# EAGLE design 4x4CherryExpansion (EAGLE 7.5.0)
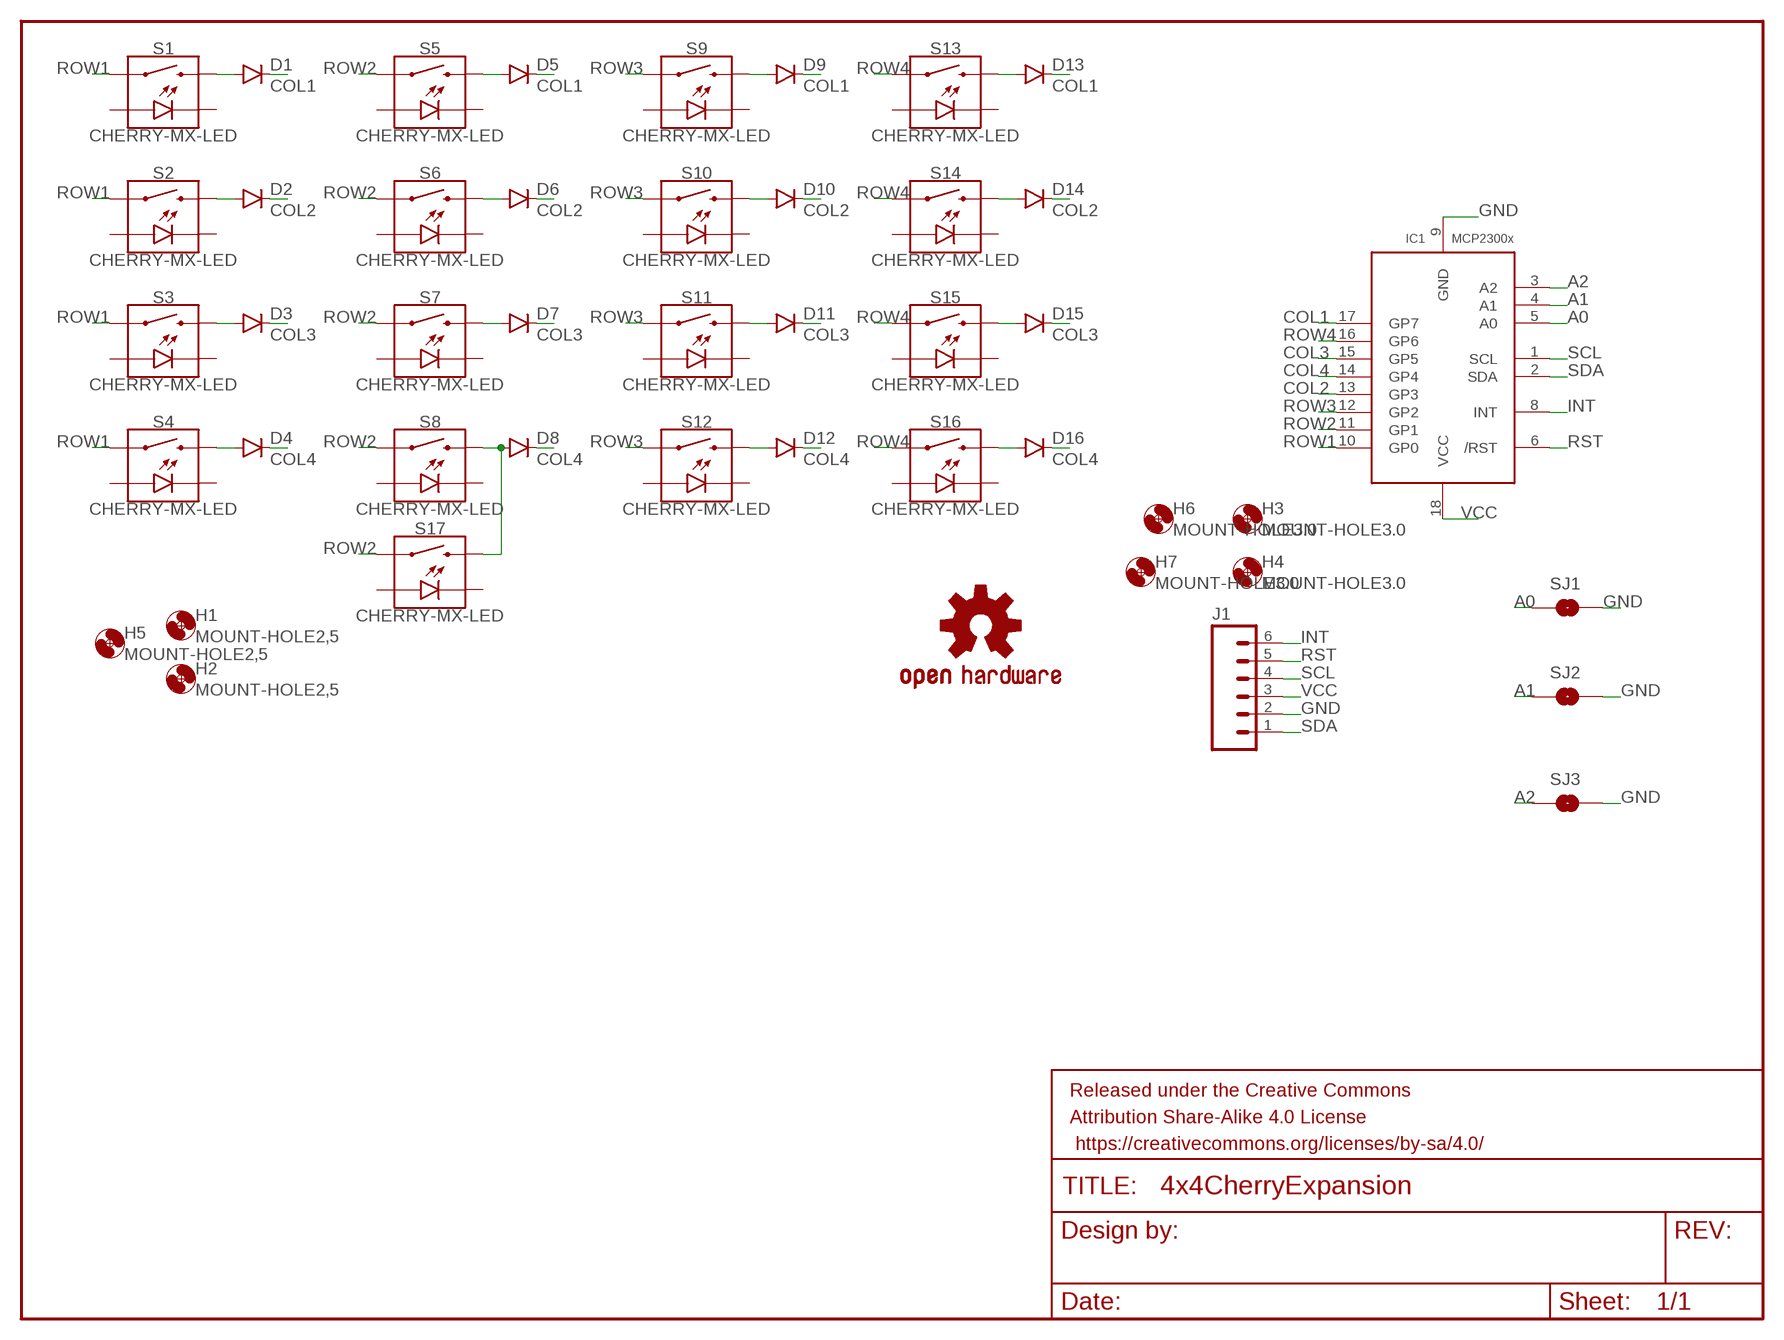
[diagram p0: schematic, sheet 1]

## Parts
D1  DIODEPTH  [DIODE-1N4001]
D2  DIODEPTH  [DIODE-1N4001]
D3  DIODEPTH  [DIODE-1N4001]
D4  DIODEPTH  [DIODE-1N4001]
D5  DIODEPTH  [DIODE-1N4001]
D6  DIODEPTH  [DIODE-1N4001]
D7  DIODEPTH  [DIODE-1N4001]
D8  DIODEPTH  [DIODE-1N4001]
D9  DIODEPTH  [DIODE-1N4001]
D10  DIODEPTH  [DIODE-1N4001]
D11  DIODEPTH  [DIODE-1N4001]
D12  DIODEPTH  [DIODE-1N4001]
D13  DIODEPTH  [DIODE-1N4001]
D14  DIODEPTH  [DIODE-1N4001]
D15  DIODEPTH  [DIODE-1N4001]
D16  DIODEPTH  [DIODE-1N4001]
FRAME1  FRAME-LETTER  [CREATIVE_COMMONS]
H1  MOUNT-HOLE2,5  [2,8]
H2  MOUNT-HOLE2,5  [2,8]
H3  MOUNT-HOLE3.0  [3,0]
H4  MOUNT-HOLE3.0  [3,0]
H5  MOUNT-HOLE2,5  [2,8]
H6  MOUNT-HOLE3.0  [3,0]
H7  MOUNT-HOLE3.0  [3,0]
IC1  MCP23008/P  [DIL18]
J1  M06SILK_FEMALE_PTH  [1X06]
LOGO1  OSHW-LOGOL  [OSHW-LOGO-L]
S1  CHERRY-MX-LED  [CHERRY-MX-LED]
S2  CHERRY-MX-LED  [CHERRY-MX-LED]
S3  CHERRY-MX-LED  [CHERRY-MX-LED]
S4  CHERRY-MX-LED  [CHERRY-MX-LED]
S5  CHERRY-MX-LED  [CHERRY-MX-LED]
S6  CHERRY-MX-LED  [CHERRY-MX-LED]
S7  CHERRY-MX-LED  [CHERRY-MX-LED]
S8  CHERRY-MX-LED  [CHERRY-MX-LED]
S9  CHERRY-MX-LED  [CHERRY-MX-LED]
S10  CHERRY-MX-LED  [CHERRY-MX-LED]
S11  CHERRY-MX-LED  [CHERRY-MX-LED]
S12  CHERRY-MX-LED  [CHERRY-MX-LED]
S13  CHERRY-MX-LED  [CHERRY-MX-LED]
S14  CHERRY-MX-LED  [CHERRY-MX-LED]
S15  CHERRY-MX-LED  [CHERRY-MX-LED]
S16  CHERRY-MX-LED  [CHERRY-MX-LED]
S17  CHERRY-MX-LED  [CHERRY-MX-LED]
SJ1  SOLDERJUMPERNO  [SJ_2S-NO]
SJ2  SOLDERJUMPERNO  [SJ_2S-NO]
SJ3  SOLDERJUMPERNO  [SJ_2S-NO]

## Nets
A0: IC1.5(A0) SJ1.1
A1: IC1.4(A1) SJ2.1
A2: IC1.3(A2) SJ3.1
COL1: D1.C D5.C D9.C D13.C IC1.17(GP7)
COL2: D2.C D6.C D10.C D14.C IC1.13(GP3)
COL3: D3.C D7.C D11.C D15.C IC1.15(GP5)
COL4: D4.C D8.C D12.C D16.C IC1.14(GP4)
GND: IC1.9(GND) J1.2 SJ1.2 SJ2.2 SJ3.2
INT: IC1.8(INT) J1.6
N$1: D9.A S9.S2
N$2: D10.A S10.S2
N$3: D1.A S1.S2
N$4: D11.A S11.S2
N$5: D12.A S12.S2
N$6: D13.A S13.S2
N$7: D14.A S14.S2
N$8: D3.A S3.S2
N$9: D2.A S2.S2
N$10: D15.A S15.S2
N$11: D16.A S16.S2
N$12: D8.A S8.S2 S17.S2
N$17: D4.A S4.S2
N$22: D5.A S5.S2
N$27: D6.A S6.S2
N$32: D7.A S7.S2
ROW1: IC1.10(GP0) S1.S1 S2.S1 S3.S1 S4.S1
ROW2: IC1.11(GP1) S5.S1 S6.S1 S7.S1 S8.S1 S17.S1
ROW3: IC1.12(GP2) S9.S1 S10.S1 S11.S1 S12.S1
ROW4: IC1.16(GP6) S13.S1 S14.S1 S15.S1 S16.S1
RST: IC1.6(/RST) J1.5
SCL: IC1.1(SCL) J1.4
SDA: IC1.2(SDA) J1.1
VCC: IC1.18(VCC) J1.3
Unconnected: S1.A S1.K(C) S2.A S2.K(C) S3.A S3.K(C) S4.A S4.K(C) S5.A S5.K(C) S6.A S6.K(C) S7.A S7.K(C) S8.A S8.K(C) S9.A S9.K(C) S10.A S10.K(C) S11.A S11.K(C) S12.A S12.K(C) S13.A S13.K(C) S14.A S14.K(C) S15.A S15.K(C) S16.A S16.K(C) S17.A S17.K(C)

## Library data of the parts
D1-D16 = SparkFun-DiscreteSemi:DIODE: Diode These are standard reverse protection diodes and small signal diodes. SMA package can handle up to about 1A. SOD-323 can handle about 200mA. What the SOD-323 package when ordering, there are some mfgs out there that are 5-pin packages.
FRAME1 = SparkFun-Aesthetics:FRAME-LETTER: Schematic Frame Standard 8.5x11 US Letter frame
H1-H7 = holes:MOUNT-HOLE: MOUNTING HOLE with drill center marker
IC1 = adafruit:MCP23008: MCP23008 Inexpensive i2c i/o expander - 8 general purpose i/o pins with optional pullups
J1 = SparkFun-Connectors:M06: Header 6 Standard 6-pin 0.1" header. Use with straight break away headers (SKU : PRT-00116), right angle break away headers (PRT-00553), swiss pins (PRT-00743), machine pins (PRT-00117), and female headers (PRT-00115). Molex polarized connector foot print use with SKU : PRT-08094 with associated crimp pins and housings. NOTES ON THE VARIANTS LOCK and LOCK_LONGPADS... This footprint was designed to help hold the alignment of a through-hole component (i.e. 6-pin header) while soldering it into place. You may notice that each hole has been shifted either up or down by 0.005 of an inch from it's more standard position (which is a perfectly straight line). This slight alteration caused the pins (the squares in the middle) to touch the edges of the holes. Because they are alternating, it causes a "brace" to hold the component in place. 0.005 has proven to be the perfect amount of "off-center" position when using our standard breakaway headers. Although looks a little odd when you look at the bare footprint, once you have a header in there, the alteration is very hard to notice. Also,if you push a header all the way into place, it is covered up entirely on the bottom side. This idea of altering the position of holes to aid alignment will be further integrated into the Sparkfun Library for other footprints. It can help hold any component with 3 or more connection pins.; PROD_ID: CONN-08437
LOGO1 = SparkFun-Aesthetics:OSHW-LOGO: Open Source Hardware Logo This logo indicates the piece of hardware it is found on incorporates a OSHW license and/or adheres to the definition of open source hardware found here: http://freedomdefined.org/OSHW
S1-S17 = SparkFun-Electromechanical:CHERRY-MX-LED: Cherry MX Switch - Electromechanical Swith w/ LED Cherry MX Keyswitches are top-of-the-line mechanical keyboard switches. They’re satisfyingly “clicky”, reliable up to tens-of-millions of key presses, and a standard in gaming and programming keyboards across the globe. This ‘blue’ version Cherry MX Switch is favored by most due to its secondary internal actuator making it less likely to “double-tap.” If you are looking for a noticeably audible and high-quality key switch, this is the perfect option for you! SparkFun Product Link <https://www.sparkfun.com/products/13834>; SF_ID: COM-13834
SJ1-SJ3 = SparkFun-Retired:SOLDERJUMPER: Solder Jumper Standard SMD solder jumper. Used to automate production. Two varients : Normally Open and Normally Closed are the same, but have different paste layers. NC will have a large amount of paste and should jumper during reflow.

## Board
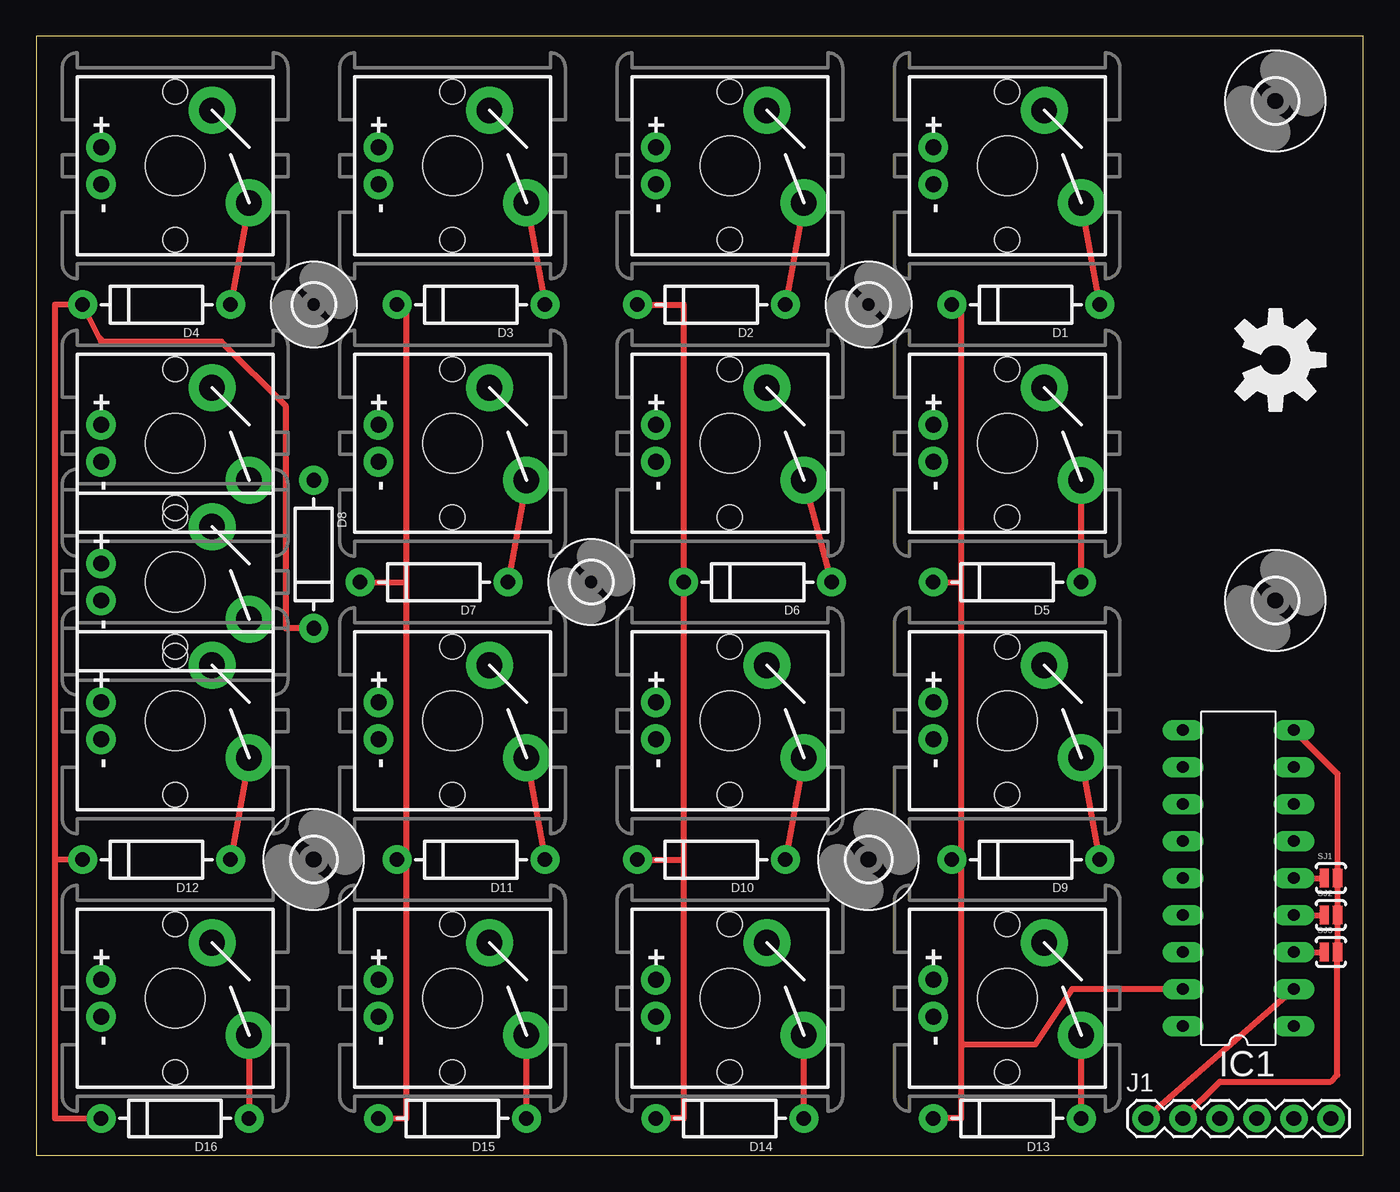
[diagram p1: board, top side]
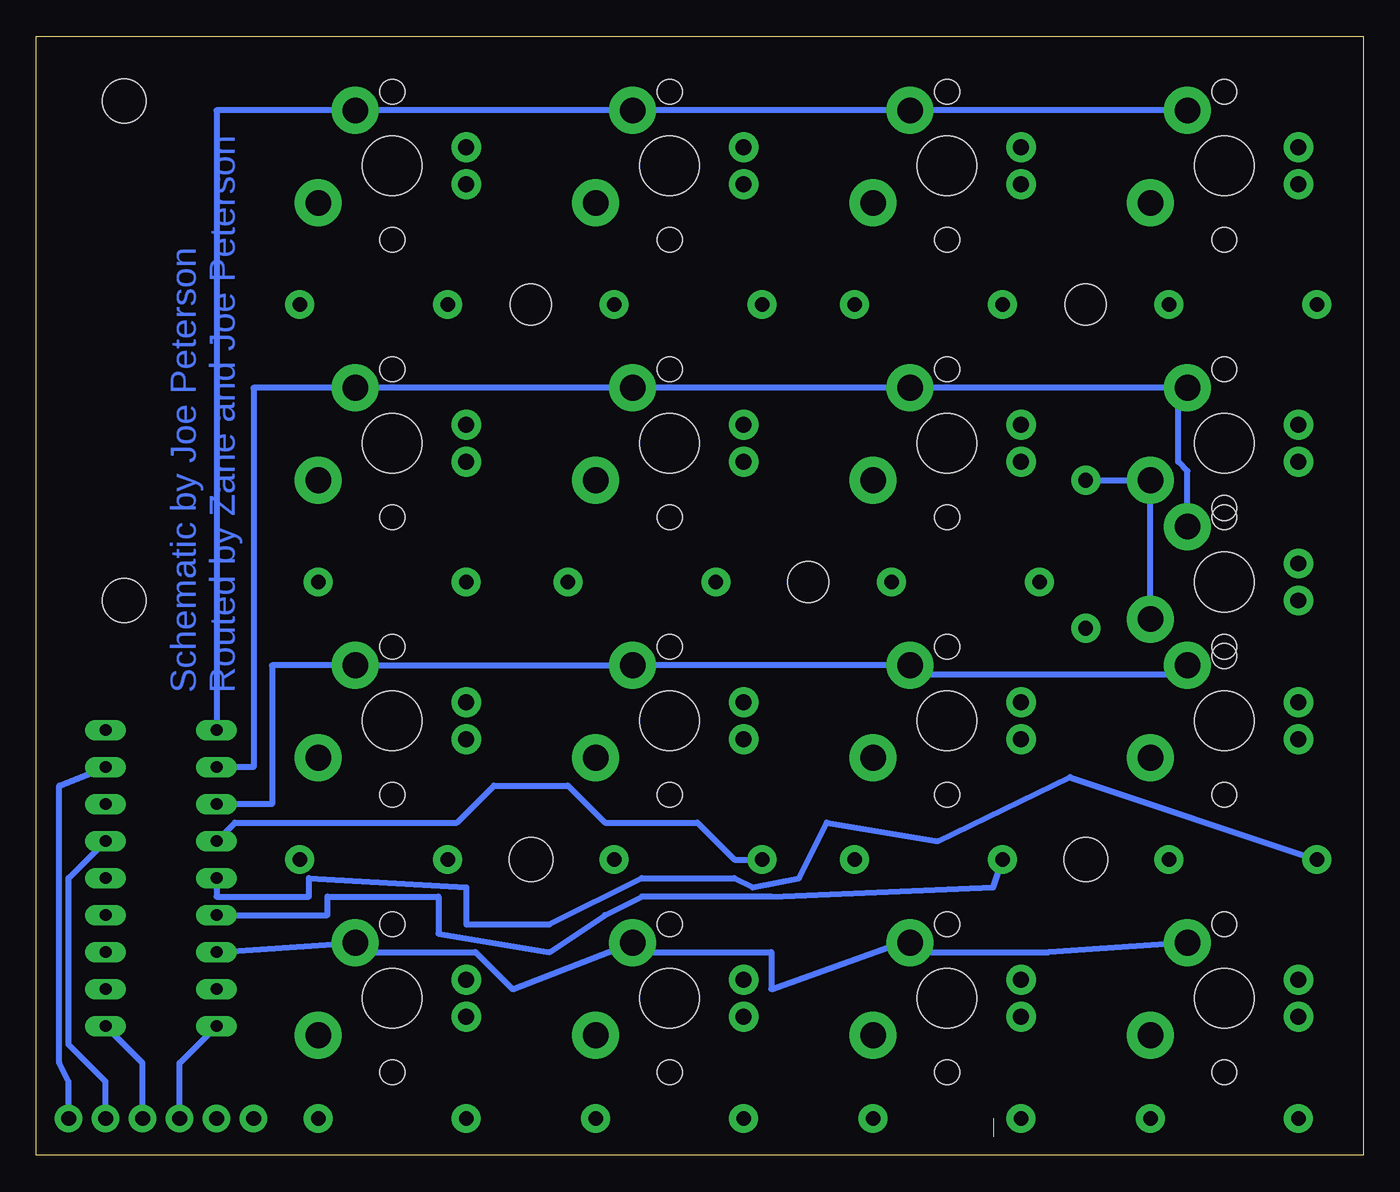
[diagram p2: board, bottom side, seen from below]

Size 91.11 x 76.83 mm. Coordinates in mm from the lower left corner, seen from the top.
Outline: 0,0 91.11,0 91.11,76.83 0,76.83 0,0
Copper layers (1*16): Top 0.035mm / dielectric 1.5mm / Bottom 0.035mm
Design rules "SparkFun": minimum track width 8mil, minimum drill 20mil, track to track 8mil, track to pad 8mil, pad to pad 8mil, via to via 8mil, smd to smd 8mil, copper to edge 8mil, drill to drill 8mil, minimum pad ring 12mil, minimum via ring 10mil, stop-mask expansion 4mil, vias tented up to drill 20mil, thermal gap 10mil

### Footprints (pad centres in the part's own frame; a part is rotated, then mirrored left to right if it is on the bottom)
DIODE-1N4001 = drill 1 pad 1.981: A -5.08,0; C 5.08,0
2,8 = hole 2.8: 0,0
3,0 = hole 3: 0,0
DIL18 = drill 0.813 long: 1 -10.16,-3.81; 2 -7.62,-3.81; 3 -5.08,-3.81; 4 -2.54,-3.81; 5 0,-3.81; 6 2.54,-3.81; 7 5.08,-3.81; 8 7.62,-3.81; 9 10.16,-3.81; 10 10.16,3.81; 11 7.62,3.81; 12 5.08,3.81; 13 2.54,3.81; 14 0,3.81; 15 -2.54,3.81; 16 -5.08,3.81; 17 -7.62,3.81; 18 -10.16,3.81
1X06 = drill 1.016 pad 1.88: 1 0,0; 2 2.54,0; 3 5.08,0; 4 7.62,0; 5 10.16,0; 6 12.7,0
CHERRY-MX-LED = drill 1.092 pad 2.032: A -1.27,-5.08; K 1.27,-5.08 | drill 1.753 pad 3.226: S1 -3.81,2.54; S2 2.54,5.08 | hole 4.089: 0,0 | hole 1.707: -5.08,0; 5.08,0
SJ_2S-NO = smd 0.635 x 1.27: 1 -0.45,0; 2 0.45,0

### Placement (x,y rotation side)
D1  67.94,58.42 180 top
D2  46.35,58.42 180 top
D3  29.84,58.42 180 top
D4  8.26,58.42 180 top
D5  66.67,39.37 180 top
D6  49.53,39.37 180 top
D7  27.3,39.37 180 top
D8  19.05,41.28 270 top
D9  67.94,20.32 180 top
D10  46.35,20.32 180 top
D11  29.84,20.32 180 top
D12  8.26,20.32 180 top
D13  66.67,2.54 180 top
D14  47.62,2.54 180 top
D15  28.57,2.54 180 top
D16  9.53,2.54 180 top
FRAME1  71.12,-5.08 180 top  (outside the outline)
H1  57.15,58.42 0 top
H2  19.05,58.42 0 top
H3  85.09,38.1 0 top
H4  85.09,72.39 0 top
H5  38.1,39.37 0 top
H6  57.15,20.32 0 top
H7  19.05,20.32 0 top
IC1  82.55,19.05 90 top
J1  76.2,2.54 0 top
LOGO1  85.09,54.61 270 top
S1  66.67,67.94 270 top
S2  47.62,67.94 270 top
S3  28.57,67.94 270 top
S4  9.53,67.94 270 top
S5  66.67,48.9 270 top
S6  47.62,48.9 270 top
S7  28.57,48.9 270 top
S8  9.53,48.9 270 top
S9  66.67,29.84 270 top
S10  47.62,29.84 270 top
S11  28.57,29.84 270 top
S12  9.53,29.84 270 top
S13  66.67,10.79 270 top
S14  47.62,10.79 270 top
S15  28.57,10.79 270 top
S16  9.53,10.79 270 top
S17  9.53,39.37 270 top
SJ1  88.9,19.05 0 top
SJ2  88.9,16.51 0 top
SJ3  88.9,13.97 0 top

### Tracks (layer width: path | path; a pad name or v marks a point on that pad's centre or on a via)
A0
  Top 0.406: IC1.5 SJ1.1
A1
  Top 0.406: IC1.4 SJ2.1
A2
  Top 0.406: IC1.3 SJ3.1
COL1
  Top 0.406: D1.C 63.5,58.42 63.5,39.37 | 63.5,39.37 63.5,20.32 | 63.5,20.32 63.5,7.62 | 63.5,7.62 63.5,2.54 D13.C | D9.C 63.5,20.32 | D5.C 63.5,39.37 | IC1.17 71.12,11.43 68.58,7.62 63.5,7.62
COL2
  Top 0.406: D2.C 44.45,58.42 D6.C 44.45,20.32 | 44.45,20.32 44.45,2.54 D14.C | D10.C 44.45,20.32
  Bottom 0.406: IC1.13 77.47,22.86 62.23,22.86 59.69,25.4 54.61,25.4 52.07,22.86 45.72,22.86 43.18,20.32 D10.C
COL3  (1 unrouted)
  Top 0.406: D3.C 25.4,58.42 25.4,39.37 | 25.4,39.37 25.4,20.32 | 25.4,20.32 25.4,2.54 D15.C | D7.C 25.4,39.37 | D11.C 25.4,20.32
  Bottom 0.406: IC1.15 71.12,16.51 71.12,17.78 63.5,17.78 63.5,15.24 55.88,13.97 52.07,16.51 49.53,17.78 40.64,17.78 25.4,18.41 D11.C
COL4
  Top 0.406: 1.27,20.32 1.27,58.42 D4.C 4.32,56.13 | 1.27,20.32 1.27,2.54 D16.C | D12.C 1.27,20.32 | 4.45,55.88 4.32,56.13 | D8.C 17.14,36.2 17.14,51.44 12.7,55.88 4.57,55.88 4.32,56.13
  Bottom 0.406: IC1.14 78.74,17.78 72.39,17.78 72.39,19.05 61.59,18.41 61.59,15.88 55.88,15.88 49.53,19.05 43.18,19.05 41.91,18.41 38.73,19.05 36.83,22.86 29.21,21.59 20.13,25.97 D12.C
GND
  Top 0.406: IC1.9 89.35,26.22 SJ1.2 SJ2.2 SJ3.2 89.35,5.53 88.9,5.08 81.28,5.08 J1.2
INT
  Bottom 0.406: J1.6 88.9,5.08 89.53,6.35 89.53,25.4 IC1.8
N$1
  Top 0.406: D9.A S9.S2
N$2
  Top 0.406: S10.S2 D10.A
N$3
  Top 0.406: D1.A S1.S2
N$4
  Top 0.406: S11.S2 D11.A
N$5
  Top 0.406: S12.S2 D12.A
N$6
  Top 0.406: D13.A S13.S2
N$7
  Top 0.406: D14.A S14.S2
N$8
  Top 0.406: S3.S2 D3.A
N$9
  Top 0.406: S2.S2 D2.A
N$10
  Top 0.406: D15.A S15.S2
N$11
  Top 0.406: S16.S2 D16.A
N$12
  Bottom 0.406: S17.S2 14.61,45.72 S8.S2 D8.A
N$17
  Top 0.406: S4.S2 D4.A
N$22
  Top 0.406: D5.A S5.S2
N$27
  Top 0.406: S6.S2 D6.A
N$32
  Top 0.406: S7.S2 D7.A
ROW1
  Bottom 0.406: S4.S1 S3.S1 S2.S1 S1.S1 78.74,71.75 IC1.10
ROW2
  Bottom 0.406: S8.S1 S7.S1 | S8.S1 S6.S1 S5.S1 76.2,52.71 76.2,26.67 IC1.11 | S17.S1 12.06,46.99 12.7,47.62 12.7,52.07 S8.S1
ROW3
  Bottom 0.406: IC1.12 74.93,24.13 74.93,33.66 S9.S1 S10.S1 S11.S1 30.48,33.02 12.7,33.02 S12.S1
ROW4
  Bottom 0.406: IC1.16 S13.S1 69.22,13.97 60.96,13.97 58.42,11.43 S14.S1 50.16,13.97 40.64,13.97 40.64,11.43 31.75,14.61 S15.S1 31.11,13.97 21.59,13.97 S16.S1
RST
  Bottom 0.406: J1.5 86.36,5.08 88.9,7.62 88.9,19.05 IC1.6
SCL
  Bottom 0.406: J1.4 83.82,6.35 IC1.1
SDA
  Top 0.406: J1.1 IC1.2
VCC
  Bottom 0.406: J1.3 81.28,6.35 IC1.18

### Text on the board
Bottom: Schematic by Joe Peterson / Routed by Zane and Joe Peterson